# EAGLE design MySLipo_v1.0 (EAGLE 7.6.0)
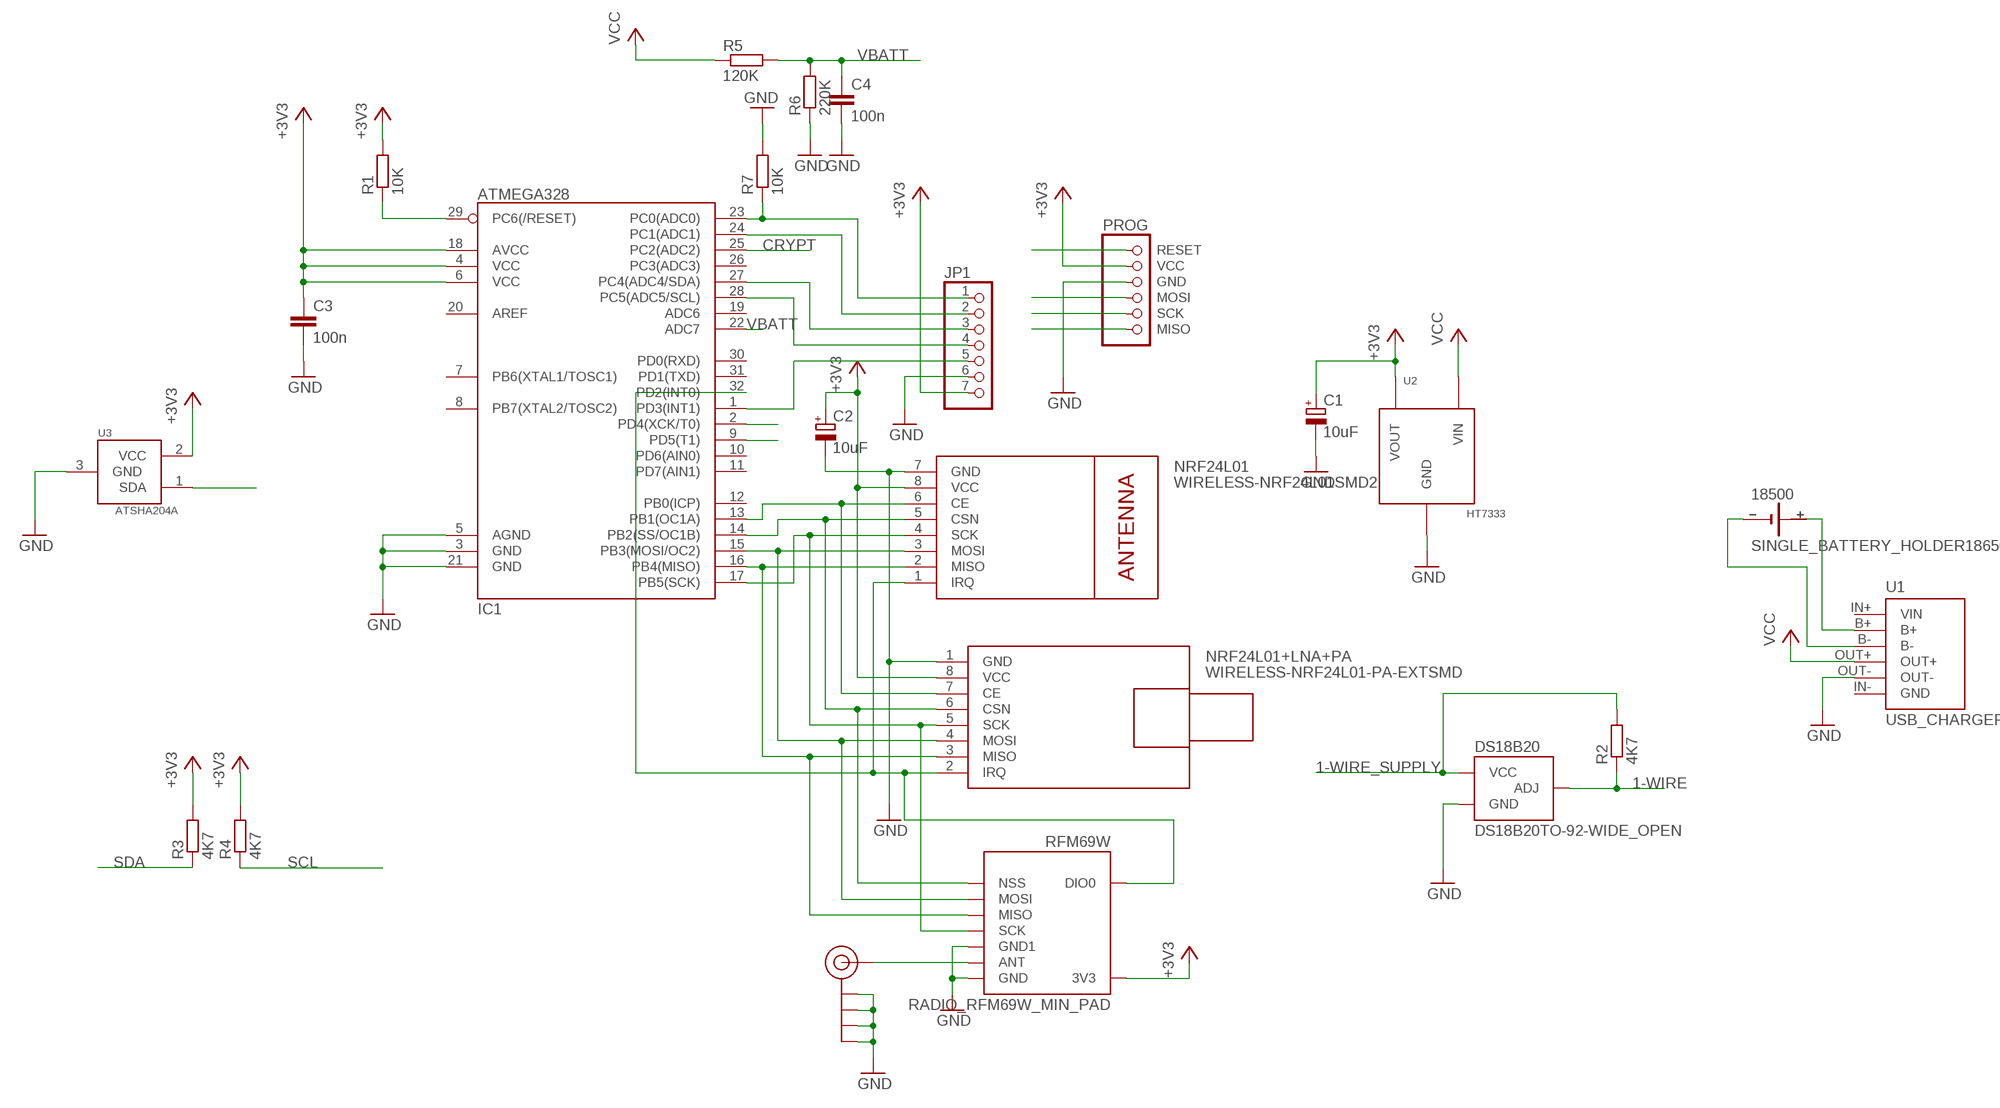
[diagram p0: schematic, sheet 1]

## Parts
18500  SINGLE_BATTERY_HOLDER18650  [18650_HOLDER]
C1  10uF  CPOL-EUSMCA  [SMC_A]
C2  10uF  CPOL-EUSMCA  [SMC_A]
C3  100n  C-EUC0805  [C0805]
C4  100n  C-EUC0805  [C0805]
DS18B20  DS18B20TO-92-WIDE_OPEN  [TO-92-WIDE_OPEN]
IC1  ATMEGA328  [TQFP32-08]
J$1  ANTENNATINY  [SMA_UFL_PAD_TINY]
JP1  PINHD-1X7  [1X07]
NRF24L01  WIRELESS-NRF24L01SMD2  [WIRELESS-NRF24L01-SMD-2]
NRF24L01+LNA+PA  WIRELESS-NRF24L01-PA-EXTSMD  [WIRELESS-NRF24L01-PA-SMD]
PROG  PROG  [PROG]
R1  10K  R-EU_R0805  [R0805]
R2  4K7  R-EU_R0805  [R0805]
R3  4K7  R-EU_R0805  [R0805]
R4  4K7  R-EU_R0805  [R0805]
R5  120K  R-EU_R0805  [R0805]
R6  220K  R-EU_R0805  [R0805]
R7  10K  R-EU_R0805  [R0805]
RFM69W  RADIO_RFM69W_MIN_PAD  [RFM69W_MIN_PAD]
U1  USB_CHARGER  [USB_CHARGER]
U2  HT7333  HT73XX  [SOT-89]
U3  ATSHA204A  IC_ATSHA204A_CRYPT  [SOT23-3]

## Nets
1-WIRE: DS18B20.G(ADJ) IC1.2(PD4(XCK/T0)) R2.1
1-WIRE_SUPPLY: DS18B20.D(VCC) IC1.9(PD5(T1)) R2.2
+3V3: C1.+ C2.+ C3.1 IC1.4(VCC) IC1.6(VCC) IC1.18(AVCC) JP1.7 NRF24L01+LNA+PA.8(VCC) NRF24L01.8(VCC) PROG.2(VCC) R1.2 R3.2 R4.2 RFM69W.8(3V3) U2.3(VOUT) U3.2(VCC)
A0: IC1.23(PC0(ADC0)) JP1.1 R7.1
A1: IC1.24(PC1(ADC1)) JP1.2
ANT: J$1.ANT1(SIGNAL) J$1.ANT2(SIGNAL) J$1.ANT3(SIGNAL) RFM69W.10(ANT)
CRYPT: IC1.25(PC2(ADC2)) U3.1(SDA)
D2: IC1.1(PD3(INT1)) JP1.5
GND: C1.- C2.- C3.2 C4.2 DS18B20.S(GND) IC1.3(GND) IC1.5(AGND) IC1.21(GND) J$1.GND1(GND) J$1.GND2(GND) J$1.GND3(GND) J$1.GND4(GND) JP1.6 NRF24L01+LNA+PA.1(GND) NRF24L01.7(GND) PROG.3(GND) R6.1 R7.2 RFM69W.9(GND) RFM69W.11(GND1) U1.OUT- U2.1(GND) U3.3(GND)
MISO: IC1.16(PB4(MISO)) NRF24L01+LNA+PA.3(MISO) NRF24L01.2(MISO) PROG.6(MISO) RFM69W.13(MISO)
MOSI: IC1.15(PB3(MOSI/OC2)) NRF24L01+LNA+PA.4(MOSI) NRF24L01.3(MOSI) PROG.4(MOSI) RFM69W.14(MOSI)
N$1: IC1.32(PD2(INT0)) NRF24L01+LNA+PA.2(IRQ) NRF24L01.1(IRQ) RFM69W.2(DIO0)
N$5: IC1.13(PB1(OC1A)) NRF24L01+LNA+PA.7(CE) NRF24L01.6(CE)
N$6: IC1.14(PB2(SS/OC1B)) NRF24L01+LNA+PA.6(CSN) NRF24L01.5(CSN) RFM69W.15(NSS)
N$8: 18500.+ U1.B+
N$9: 18500.- U1.B-
RESET: IC1.29(PC6(/RESET)) PROG.1(RESET) R1.1
SCK: IC1.17(PB5(SCK)) NRF24L01+LNA+PA.5(SCK) NRF24L01.4(SCK) PROG.5(SCK) RFM69W.12(SCK)
SCL: IC1.28(PC5(ADC5/SCL)) JP1.4 R4.1
SDA: IC1.27(PC4(ADC4/SDA)) JP1.3 R3.1
VBATT: C4.1 IC1.22(ADC7) R5.2 R6.2
VCC: R5.1 U1.OUT+ U2.2(VIN) U2.2@1(VIN)
Unconnected: IC1.7(PB6(XTAL1/TOSC1)) IC1.8(PB7(XTAL2/TOSC2)) IC1.10(PD6(AIN0)) IC1.11(PD7(AIN1)) IC1.12(PB0(ICP)) IC1.19(ADC6) IC1.20(AREF) IC1.26(PC3(ADC3)) IC1.30(PD0(RXD)) IC1.31(PD1(TXD)) U1.IN+(VIN) U1.IN-(GND)

## Library data of the parts
18500 = moje:SINGLE_BATTERY_HOLDER: Li-Po battery
C1 C2 = rcl:CPOL-EU: POLARIZED CAPACITOR, European symbol
C3 C4 = rcl:C-EU: CAPACITOR, European symbol
DS18B20 = moje:DS18B20: TO-92 temp sensor
IC1 = moje:ATMEGA328
J$1 = WeMos-Lora:ANTENNA: SMA Antenna Connector End launch SMA connector. The paste layer has been removed so that the connector can be hand soldered onto the board after reflow.
JP1 = pinhead:PINHD-1X7: PIN HEADER
NRF24L01 = nrf24l01plus:WIRELESS-NRF24L01: 2.4 GHz Wireless Module based on NRF24L01 chip
NRF24L01+LNA+PA = nrf24l01plus:WIRELESS-NRF24L01-PA-EXT: 2.4 GHz Wireless Module based on NRF24L01 chip with preamplifier and external antenna
PROG = moje:PROG: PIN HEADER
R1-R7 = rcl:R-EU_: RESISTOR, European symbol
RFM69W = mysensors:RADIO_RFM69W_MIN_PAD
U1 = moje:USB_CHARGER
U2 = moje:HT73XX: Low Power Consumption LDO
U3 = mysensors:IC_ATSHA204A_CRYPT

## Board
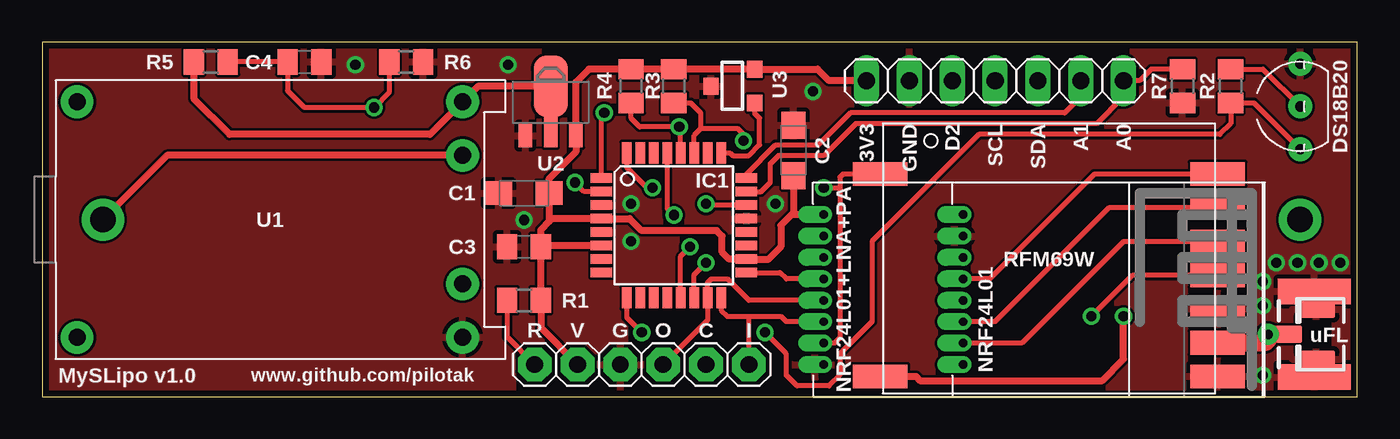
[diagram p1: board, top side]
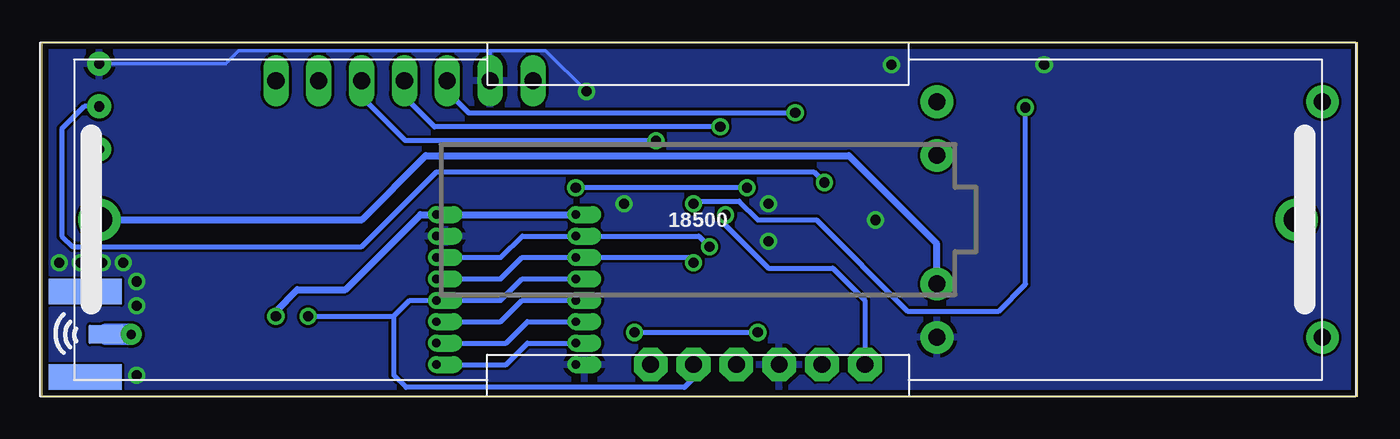
[diagram p2: board, bottom side, seen from below]

Size 78 x 21 mm. Coordinates in mm from the lower left corner, seen from the top.
Outline: 0,0 78,0 78,21 0,21 0,0
Copper layers (1*16): Top 0.0356mm / dielectric 1.5011mm / Bottom 0.0356mm
Design rules "PCBs_io": minimum track width 6mil, minimum drill 13mil, track to track 6mil, track to pad 6mil, pad to pad 6mil, via to via 6mil, smd to smd 6mil, copper to edge 15mil, drill to drill 6mil, minimum pad ring 7mil, minimum via ring 7mil, stop-mask expansion 3mil, vias tented up to drill 0.6mm, thermal gap 10mil

### Footprints (pad centres in the part's own frame; a part is rotated, then mirrored left to right if it is on the bottom)
18650_HOLDER = drill 1.5 pad 2.5: + 35.5,0; - -35.5,0
SMC_A = smd 1.6 x 1.4: + -1.5,0; - 1.5,0
C0805 = smd 1.2 x 1.5: 1 -1,0; 2 1,0
TO-92-WIDE_OPEN = drill 0.6 pad 1.422: D -2.54,0; G 0,0; S 2.54,0
TQFP32-08 = smd 1.27 x 0.559: 1 -4.293,2.8; 2 -4.293,2; 3 -4.293,1.2; 4 -4.293,0.4; 5 -4.293,-0.4; 6 -4.293,-1.2; 7 -4.293,-2; 8 -4.293,-2.8; 17 4.293,-2.8; 18 4.293,-2; 19 4.293,-1.2; 20 4.293,-0.4; 21 4.293,0.4; 22 4.293,1.2; 23 4.293,2; 24 4.293,2.8 | smd 0.559 x 1.27: 9 -2.8,-4.293; 10 -2,-4.293; 11 -1.2,-4.293; 12 -0.4,-4.293; 13 0.4,-4.293; 14 1.2,-4.293; 15 2,-4.293; 16 2.8,-4.293; 25 2.8,4.293; 26 2,4.293; 27 1.2,4.293; 28 0.4,4.293; 29 -0.4,4.293; 30 -1.2,4.293; 31 -2,4.293; 32 -2.8,4.293
SMA_UFL_PAD_TINY = smd 1.524 x 1.016: ANT1 -3.843,0 | drill 0.559 pad 1.27: ANT2 -5.08,0 | smd 2.032 x 1.143 bottom: ANT3 -3.589,0 | smd 2.2 x 1.016: GND1 -2.223,1.47; GND2 -2.223,-1.47 | smd 4.318 x 1.524: GND3 -2.349,-2.54; GND4 -2.349,2.54 | smd 4.318 x 1.524 bottom: GND5 -2.349,2.54; GND6 -2.349,-2.54
1X07 = drill 1.016 long: 1 -7.62,0; 2 -5.08,0; 3 -2.54,0; 4 0,0; 5 2.54,0; 6 5.08,0; 7 7.62,0
WIRELESS-NRF24L01-SMD-2 = drill 0.5 pad 1.016 offset: 1 1.905,0; 2 1.905,1.27; 3 1.905,2.54; 4 1.905,3.81; 5 1.905,5.08; 6 1.905,6.35; 7 1.905,7.62; 8 1.905,8.89
WIRELESS-NRF24L01-PA-SMD = drill 0.5 pad 1.016 offset: 1 0.635,1.905; 2 0.635,3.175; 3 0.635,4.445; 4 0.635,5.715; 5 0.635,6.985; 6 0.635,8.255; 7 0.635,9.525; 8 0.635,10.795
PROG = drill 1 pad 2 octagon: 1 -6.35,0; 2 -3.81,0; 3 -1.27,0; 4 1.27,0; 5 3.81,0; 6 6.35,0
R0805 = smd 1.2 x 1.5: 1 -1,0; 2 1,0
RFM69W_MIN_PAD = smd 3.25 x 1.4: 2 -10,5; 8 -10,-7; 9 10,-7; 10 10,-5; 11 10,-3; 12 10,-1; 13 10,1; 14 10,3; 15 10,5
USB_CHARGER = drill 1 pad 1.93: B+ -3.81,11.43; B- 3.81,11.43; IN+ -6.985,-11.43; IN- 6.985,-11.43; OUT+ -6.985,11.43; OUT- 6.985,11.43
SOT-89 = smd 0.8 x 1.4: 1 -1.499,-1.981; 3 1.499,-1.981 | smd 0.8 x 1.9: 2 0,-1.727 | smd 2.032 x 3.65: 2@1 0,0.94
SOT23-3 = smd 1 x 0.9: 1 -1,-1.3; 2 1,-1.3; 3 0,1.3

### Placement (x,y rotation side)
18500  39.1,10.5 0 bottom
C1  28.57,12.06 180 top
C2  44.55,14.61 90 top
C3  28.57,8.89 180 top
C4  15.56,19.84 0 top
DS18B20  74.61,17.21 90 top
IC1  37.47,10.16 0 top
J$1  77.8,3.7 0 top
JP1  56.52,18.73 180 top
NRF24L01  52.7,1.91 0 top
NRF24L01+LNA+PA  45.72,0 0 top
PROG  35.56,1.91 0 top
R1  28.57,5.71 0 top
R2  70.48,18.41 270 top
R3  37.47,18.41 90 top
R4  34.92,18.41 90 top
R5  10,19.84 0 top
R6  21.59,19.84 180 top
R7  67.63,18.41 270 top
RFM69W  59.7,8.2 0 top
U1  13.51,10.5 270 top
U2  30.16,17.46 0 top
U3  40.96,18.41 90 top

### Tracks (layer width: path | path; a pad name or v marks a point on that pad's centre or on a via)
1-WIRE  (via drill 0.6 pad 1.02)
  Top 0.305: IC1.2 32.15,12.16 v31.61,12.7 | R2.1 72.41,19.41 DS18B20.G
  Bottom 0.305: v31.61,12.7 32.24,13.34 54.61,13.34 59.05,8.89 76.2,8.89 76.83,9.53 76.83,15.88 75.5,17.21 DS18B20.G
1-WIRE_SUPPLY  (via drill 0.6 pad 1.02)
  Top 0.305: IC1.9 34.66,4.71 v35.56,3.81 | DS18B20.D 71.86,17.41 R2.2 70.48,16.19 69.85,15.56 55.56,15.56 49.21,9.21 49.21,4.45 47.31,2.54 47.31,1.27 46.67,0.64 44.77,0.64 44.13,1.27 44.13,2.54 v42.86,3.81
  Bottom 0.305: v42.86,3.81 v35.56,3.81
+3V3  (via drill 0.6 pad 1.02)
  Top 0.406: C3.1 R1.2 29.57,4.08 PROG.2 | C3.1 29.57,9.89 30.07,10.39 | 30.07,10.39 C1.+ 30.07,12.93 31.66,14.52 U2.3 31.66,18.64 32.43,19.41 R4.2 R3.2 U3.2 45.99,19.41 46.67,18.73 JP1.7 | 30.07,10.39 30.25,10.56 IC1.4 34.84,10.56 35.56,9.84 40.01,9.84 40.32,9.53 40.32,8.57 40.73,8.16 IC1.18 43.09,8.16 43.81,8.89 43.81,10.16 44.45,10.79 | IC1.6 29.64,8.96 C3.1 | NRF24L01+LNA+PA.8 44.45,10.79 | RFM69W.8 51.82,1.2 52.07,0.95 62.87,0.95 64.14,2.22 v64.14,4.76 | C2.+ 44.55,10.9 44.45,10.79
  Bottom 0.406: NRF24L01+LNA+PA.8 NRF24L01.8 55.56,10.79 60.01,6.35 62.87,6.35 64.14,5.08 v64.14,4.76
A0
  Top 0.305: IC1.23 42.64,12.16 43.18,12.7 43.18,13.81 43.66,14.29 46.35,14.29 48.26,16.19 62.55,16.19 64.14,17.78 JP1.1 65.09,18.73 65.77,19.41 R7.1
A1
  Top 0.305: IC1.24 41.76,13.18 43.5,14.92 46.04,14.92 47.94,16.83 60.64,16.83 61.59,17.78 JP1.2
ANT
  Top 1.016: J$1.ANT1 J$1.ANT2 arc-90 72.53,3.2 RFM69W.10
  Bottom 1.27: J$1.ANT3 J$1.ANT2
CRYPT
  Top 0.305: IC1.25 40.79,14.45 40.96,14.29 41.91,14.29 42.55,14.92 42.55,16.51 42.26,16.8 U3.1
D2  (via drill 0.6 pad 1.02)
  Top 0.305: IC1.1 33.17,16.66 v33.34,16.83
  Bottom 0.305: v33.34,16.83 52.7,16.83 53.98,18.1 JP1.5
GND  (via drill 0.6 pad 1.02)
  Top 0.305: J$1.GND4 75.45,5.3 J$1.GND1 | J$1.GND2 75.58,1.29 J$1.GND3
  Bottom 0.2: 51.44,20.51 48.13,20.51 v45.72,18.1 | 51.44,20.51 66.36,20.51 67.12,19.75 DS18B20.S | JP1.6 51.44,20.51
  other vias: 34.92,11.43 43.5,11.43 34.92,9.21 76.99,7.94 75.72,7.94 74.45,7.94 73.18,7.94 72.39,6.83 28.57,10.48 27.62,19.68 18.57,19.68 72.39,5.4 72.39,1.27
  pour Bottom: 0,0 0,21.59 78.74,21.59 78.74,0
  pour Top: 0,0 0,21.59 78.74,21.59 78.74,0
MISO
  Top 0.305: NRF24L01+LNA+PA.3 44.13,4.45 43.81,4.76 41.91,4.76 | 41.91,4.76 40.64,4.76 40.27,5.14 IC1.16 | RFM69W.13 64.13,9.2 58.1,3.17 NRF24L01.2 | PROG.6 41.91,4.76
  Bottom 0.305: NRF24L01.2 50.48,3.17 49.21,4.45 NRF24L01+LNA+PA.3
MOSI
  Top 0.305: NRF24L01+LNA+PA.4 41.91,5.71 40.64,6.99 39.69,6.99 39.47,6.76 IC1.15 39.47,4.54 PROG.4 | RFM69W.14 63.27,11.2 56.52,4.45 NRF24L01.3
  Bottom 0.305: NRF24L01.3 50.8,4.45 49.53,5.71 NRF24L01+LNA+PA.4
N$1  (via drill 0.6 pad 1.02)
  Top 0.3: v46.35,12.38 47.31,12.38 | 47.31,12.38 47.31,3.49 46.99,3.17 NRF24L01+LNA+PA.2 | RFM69W.2 47.49,13.2 47.31,13.02 47.31,12.38
  Top 0.305: IC1.32 34.66,13.6 35.88,12.38 v36.2,12.38
  Bottom 0.3: v36.2,12.38 v46.35,12.38
  Bottom 0.305: NRF24L01.1 50.48,1.91 49.21,3.17 NRF24L01+LNA+PA.2
N$4
  cutout Top: 41.59,13.34 41.27,13.34 40.64,14.29 41.59,13.97
N$5  (via drill 0.6 pad 1.02)
  Top 0.3: IC1.13 37.87,8.34 v38.42,8.89
  Bottom 0.3: NRF24L01+LNA+PA.7 39.05,9.53 v38.42,8.89
  Bottom 0.305: NRF24L01.6 50.8,8.26 49.53,9.53 NRF24L01+LNA+PA.7
N$6  (via drill 0.6 pad 1.02)
  Top 0.3: IC1.14 38.66,7.23 v39.37,7.94
  Top 0.305: RFM69W.15 62.41,13.2 56.2,6.99 NRF24L01.5
  Bottom 0.3: NRF24L01+LNA+PA.6 39.69,8.26 v39.37,7.94
  Bottom 0.305: NRF24L01.5 50.8,6.99 49.53,8.26 NRF24L01+LNA+PA.6
N$7
  cutout Top: 52.39,19.37 52.39,18.1 50.48,18.1 50.48,19.37
N$8
  Top 0.406: 18500.+ 7.42,14.31 U1.B+
N$9
  Bottom 0.406: U1.B- 24.93,9.06 30.16,14.29 55.24,14.29 59.03,10.5 18500.-
N$12
  cutout Top: 34.92,2.54 34.92,4.13 36.2,4.13 36.2,2.54
N$13
  cutout Top: 28.89,1.27 28.26,1.27 28.26,0.32 28.89,0.32
N$14
  cutout Top: 33.34,12.06 33.34,8.89 32.38,8.89 32.38,12.06
N$15
  cutout Top: 33.02,13.34 31.43,13.34 31.43,12.7 33.02,12.7
RESET  (via drill 0.6 pad 1.02)
  Top 0.305: IC1.29 37.06,11.17 v37.47,10.77 | R1.1 27.57,3.54 PROG.1
  Bottom 0.305: v37.47,10.77 37.47,10.16 34.92,7.62 31.11,7.62 29.21,5.71 PROG.1
SCK  (via drill 0.6 pad 1.02)
  Top 0.305: NRF24L01+LNA+PA.5 44.13,6.99 43.76,7.36 IC1.17 | RFM69W.12 64.67,7.2 v62.23,4.76
  Bottom 0.3: 57.15,1.27 56.43,0.55 39.91,0.55 39.37,1.08
  Bottom 0.305: NRF24L01+LNA+PA.5 49.53,6.99 50.8,5.71 NRF24L01.4 56.2,5.71 57.15,4.76 | v62.23,4.76 57.15,4.76 | 57.15,4.76 57.15,1.27 | PROG.5 39.37,1.08
SCL  (via drill 0.6 pad 1.02)
  Top 0.305: IC1.28 37.87,15.92 v37.78,16 35.44,16 34.92,16.51 R4.1
  Bottom 0.305: JP1.4 56.52,17.78 54.73,16 v37.78,16
SDA  (via drill 0.6 pad 1.02)
  Top 0.305: IC1.27 38.66,15.49 39.05,15.88 | R3.1 38.47,17.41 39.05,16.83 39.05,15.88 | v41.59,15.18 41.59,15.56 41.27,15.88 39.05,15.88
  Bottom 0.305: JP1.3 59.05,17.78 56.45,15.18 v41.59,15.18
VBATT  (via drill 0.6 pad 1.02)
  Top 0.305: IC1.22 39.44,11.36 v39.37,11.43 | R6.2 20.59,18.05 v19.68,17.14 15.56,17.14 14.56,18.14 C4.1 R5.2
  Bottom 0.305: v19.68,17.14 19.68,6.67 21.27,5.08 26.67,5.08 32.07,10.48 35.56,10.48 36.67,11.59 39.21,11.59 v39.37,11.43
VCC
  Top 0.406: U2.2 U2.2@1 25.85,18.4 U1.OUT+ 23.01,15.56 11.11,15.56 9,17.67 R5.1

### Text on the board
tSilk: 3V3 | GND | D2 | SCL | SDA | A1 | A0 | R | V | G | O | C | I | MySLipo v1.0 | www.github.com/pilotak